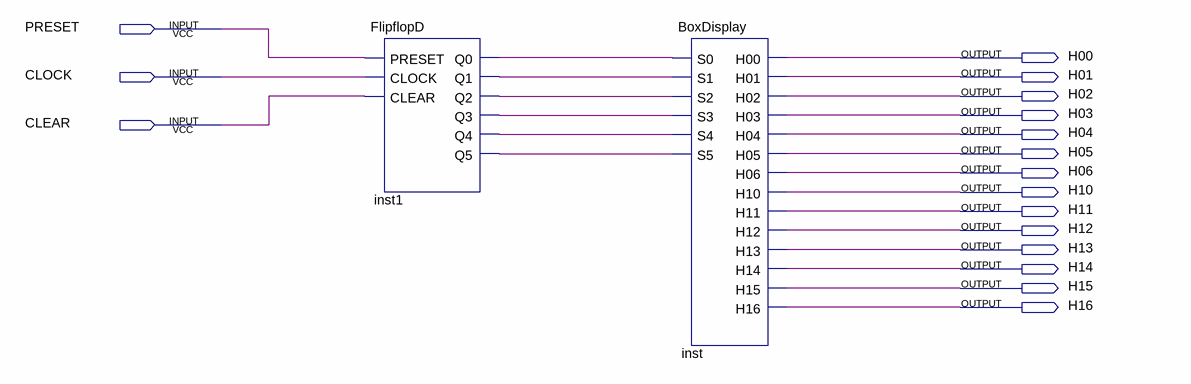
[diagram p0: schematic sheet]
// Quartus schematic Contador6bits.bdf as structural Verilog: 2 symbols, 17 pins
module Contador6bits (
  input  PRESET,
  input  CLOCK,
  input  CLEAR,
  output H00,
  output H01,
  output H02,
  output H03,
  output H04,
  output H05,
  output H06,
  output H10,
  output H11,
  output H12,
  output H13,
  output H14,
  output H15,
  output H16
);

  wire inst1_q0, inst1_q1, inst1_q2, inst1_q3, inst1_q4, inst1_q5;

  FlipflopD inst1 (
    .PRESET(PRESET), .CLOCK(CLOCK), .CLEAR(CLEAR), .Q0(inst1_q0), .Q1(inst1_q1), .Q2(inst1_q2),
    .Q3(inst1_q3), .Q4(inst1_q4), .Q5(inst1_q5));
  BoxDisplay inst (
    .S0(inst1_q0), .S1(inst1_q1), .S2(inst1_q2), .S3(inst1_q3), .S4(inst1_q4), .S5(inst1_q5), .H00(H00),
    .H01(H01), .H02(H02), .H03(H03), .H04(H04), .H05(H05), .H06(H06), .H10(H10), .H11(H11), .H12(H12),
    .H13(H13), .H14(H14), .H15(H15), .H16(H16));
endmodule
